# Altium schematic sheet A2541WV-10P_2021-01-10.schdoc
size 59 x 30 mm
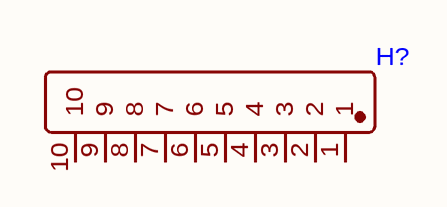
[diagram p0: A2541WV-10P_2021-01-10.schdoc]

## Parts
H?  (no value)  [HDR-TH_10P-P2.54-V]

## Nets

Not connected (* = marked no-connect by the designer): H? 1 2 3 4 5 6 7 8 9 10

## Library data of the parts
H? = A2541WV-10P